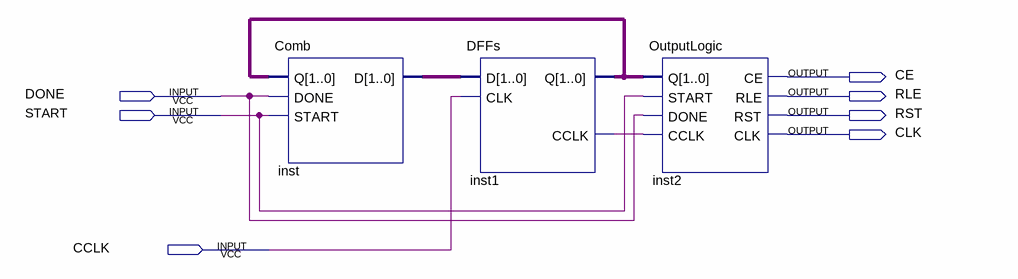
[diagram p0: schematic sheet]
// Quartus schematic Controller.bdf as structural Verilog: 3 symbols, 7 pins
module Controller (
  input  DONE,
  input  START,
  input  CCLK,
  output CE,
  output RLE,
  output RST,
  output CLK
);

  wire inst1_cclk;
  wire [1:0] inst1_q, inst_d;

  Comb inst (.Q(inst1_q), .DONE(DONE), .START(START), .D(inst_d));
  DFFs inst1 (.D(inst_d), .CLK(CCLK), .Q(inst1_q), .CCLK(inst1_cclk));
  OutputLogic inst2 (
    .Q(inst1_q), .START(START), .DONE(DONE), .CCLK(inst1_cclk), .CE(CE), .RLE(RLE), .RST(RST), .CLK(CLK));
endmodule
